# Altium project racer.PrjPcb
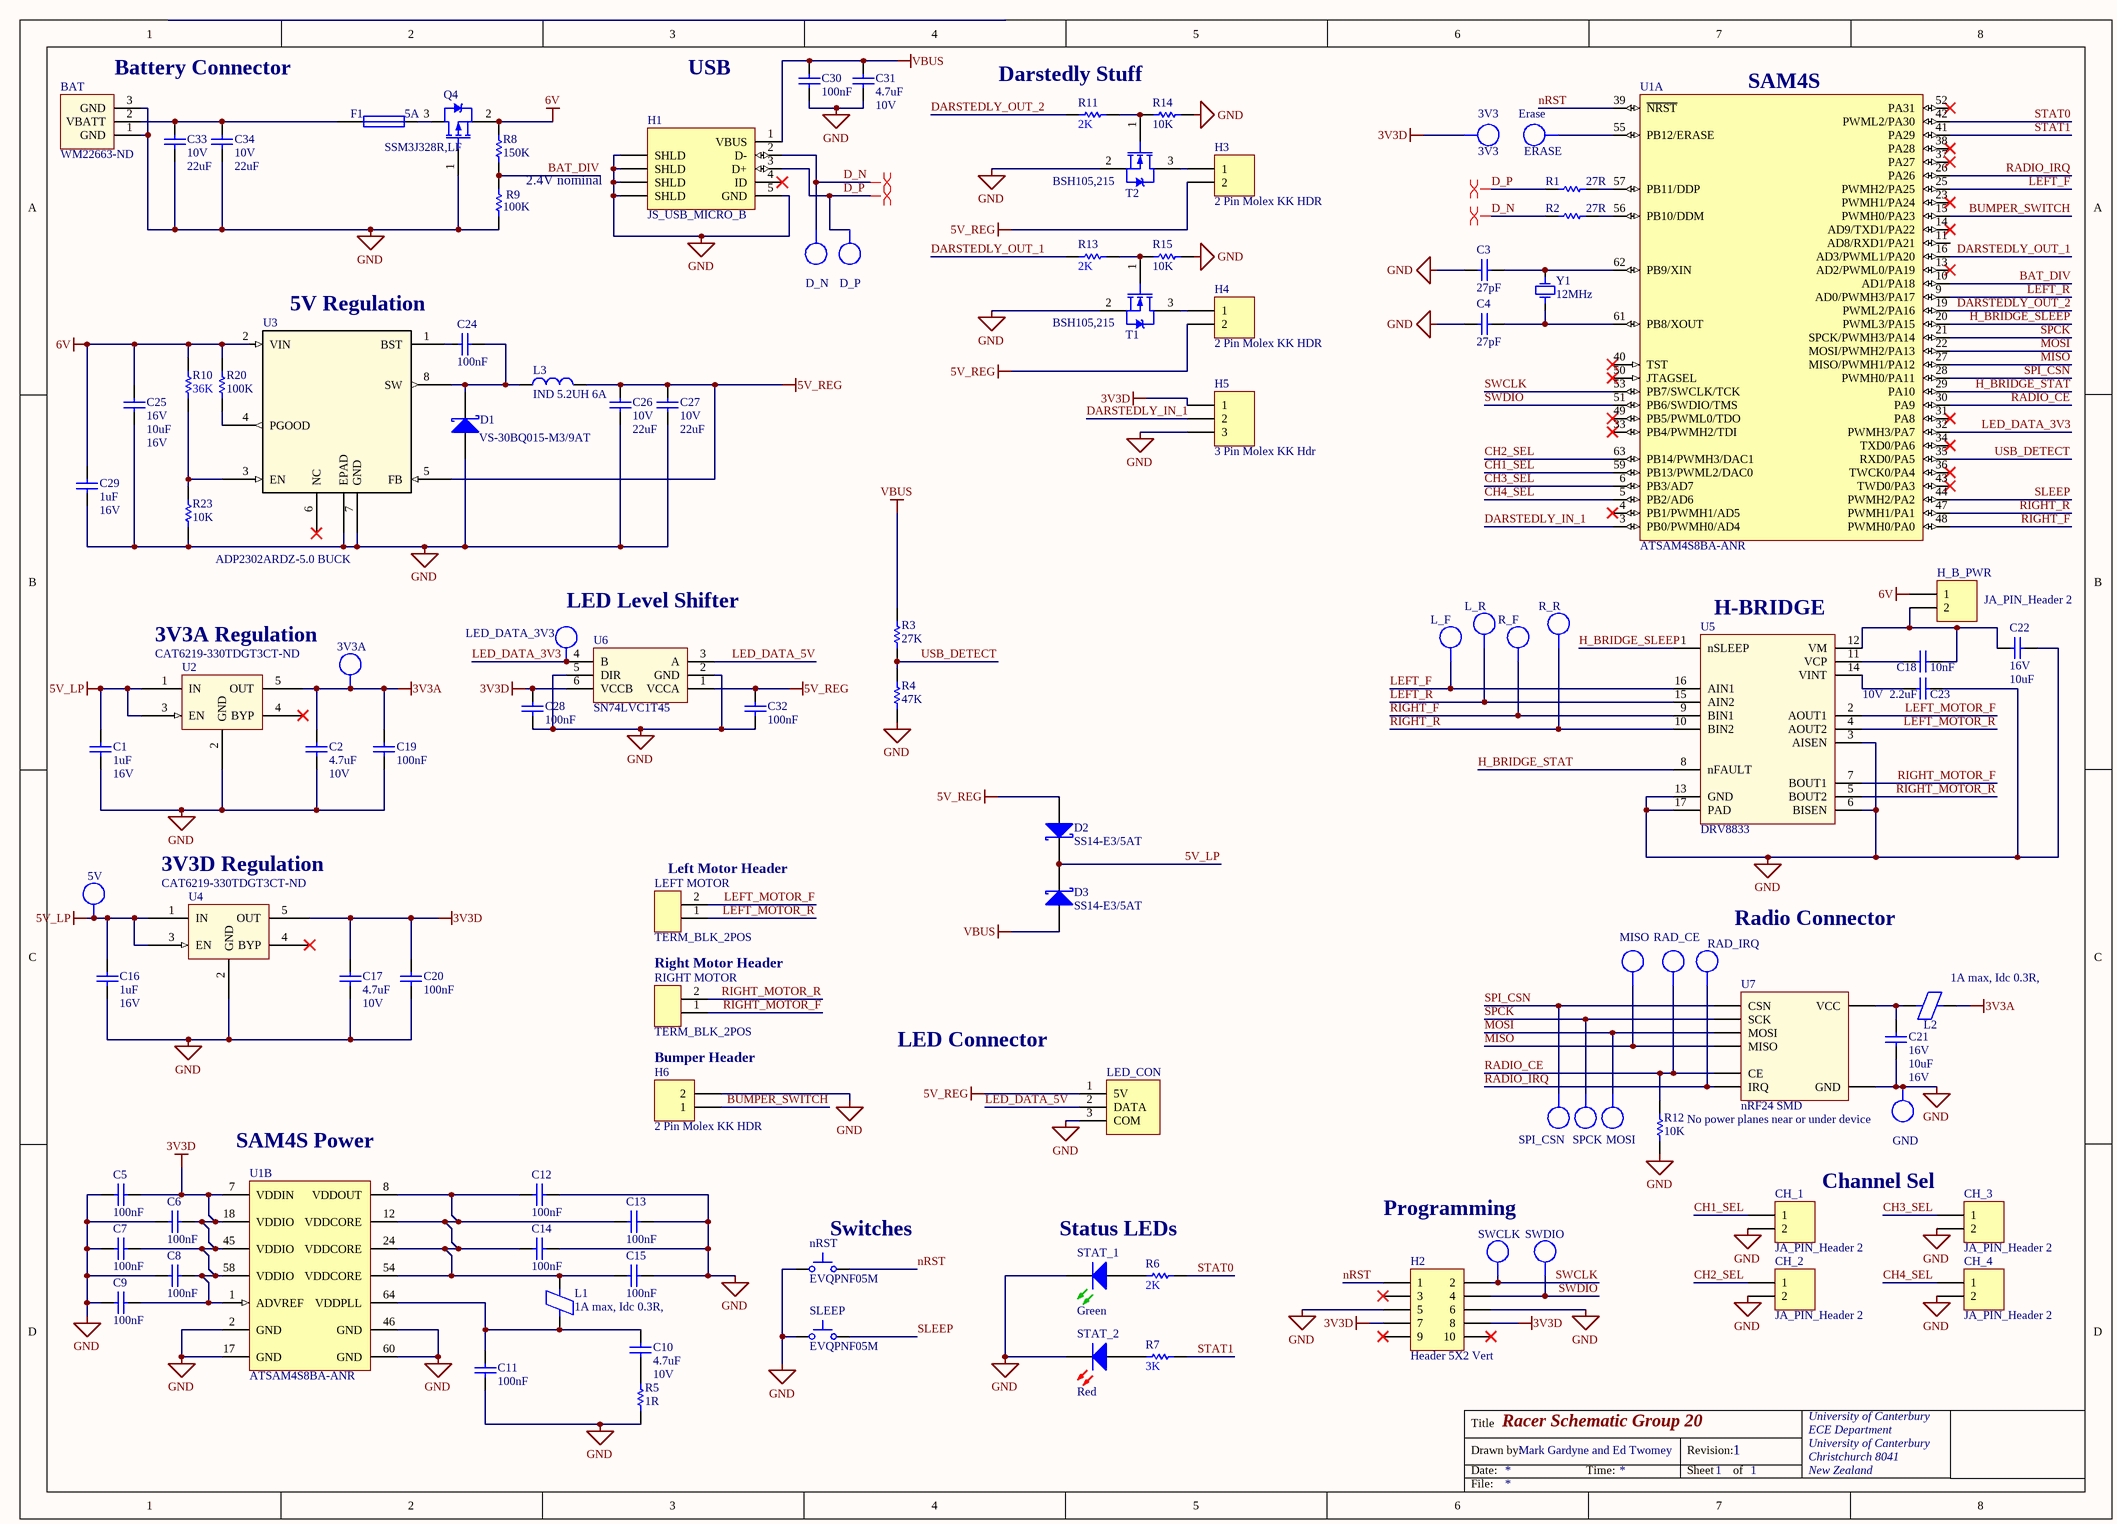
[diagram p0: MCU.SchDoc]
1 sheet, 108 parts. Net scope: global (net labels, ports and power ports of the same name join across sheets).
Board file: racer_pcb.PcbDoc

## Sheet MCU.SchDoc: Racer Schematic Group 20
size A3; Author: Group 20; DrawnBy: Mark Gardyne and Ed Twomey; Organization: University of Canterbury; Address1: ECE Department; Address2: University of Canterbury; Address3: Christchurch 8041; Address4: New Zealand; Revision: 1; SheetNumber: 1; SheetTotal: 1; ImagePath: \\maxwell\elecapp\AltiumDesigner\Templates\uc-logo.png

### Parts
3V3  3V3  [TP_1206]  (no BOM)
3V3A  TP  [TP_1206]  (value not drawn)  (no BOM)
5V  TP  [TP_1206]  (value not drawn)  (no BOM)
BAT  Supplier Part Number 1: WM22663-ND  [BATT_HEADER_3POS]  (hidden comment: Battery_HEADER_3pin)
C1  Max Voltage: 16V  [CAPC1608L]  (hidden comment: 1uF)
C2  Max Voltage: 10V  [CAPC1608N]  (hidden comment: 4.7uF)
C3  27pF  [CAPC1608L]
C4  27pF  [CAPC1608L]
C5  100nF  [CAPC1608L]
C6  100nF  [CAPC1608L]
C7  100nF  [CAPC1608L]
C8  100nF  [CAPC1608L]
C9  100nF  [CAPC1608L]
C10  Max Voltage: 10V  [CAPC1608N]  (hidden comment: 4.7uF)
C11  100nF  [CAPC1608L]
C12  100nF  [CAPC1608L]
C13  100nF  [CAPC1608L]
C14  100nF  [CAPC1608L]
C15  100nF  [CAPC1608L]
C16  Max Voltage: 16V  [CAPC1608L]  (hidden comment: 1uF)
C17  Max Voltage: 10V  [CAPC1608N]  (hidden comment: 4.7uF)
C18  10nF  [CAPC1608L]
C19  100nF  [CAPC1608L]
C20  100nF  [CAPC1608L]
C21  Voltage - Rated: 16V  [CAPC2012L]  (hidden comment: 10uF)
C22  Voltage - Rated: 16V  [CAPC2012L]  (hidden comment: 10uF)
C23  Max Voltage: 10V  [CAPC1608L]  (hidden comment: 2.2uF)
C24  100nF  [CAPC1608L]
C25  Voltage - Rated: 16V  [CAPC2012L]  (hidden comment: 10uF)
C26  Max Voltage: 10V  [CAPC3216L]  (hidden comment: 22uF)
C27  Max Voltage: 10V  [CAPC3216L]  (hidden comment: 22uF)
C28  100nF  [CAPC1608L]
C29  Max Voltage: 16V  [CAPC1608L]  (hidden comment: 1uF)
C30  100nF  [CAPC1608L]
C31  Max Voltage: 10V  [CAPC1608N]  (hidden comment: 4.7uF)
C32  100nF  [CAPC1608L]
C33  Max Voltage: 10V  [CAPC3216L]  (hidden comment: 22uF)
C34  Max Voltage: 10V  [CAPC3216L]  (hidden comment: 22uF)
CH_1  JA_PIN_Header 2  [HDR1X2]
CH_2  JA_PIN_Header 2  [HDR1X2]
CH_3  JA_PIN_Header 2  [HDR1X2]
CH_4  JA_PIN_Header 2  [HDR1X2]
D1  VS-30BQ015-M3/9AT  [SMC]
D2  SS14-E3/5AT  [DIOM4227X23N]
D3  SS14-E3/5AT  [DIOM4227X23N]
D_N  TP  [TP_1206]  (value not drawn)  (no BOM)
D_P  TP  [TP_1206]  (value not drawn)  (no BOM)
ERASE  Erase  [TP_1206]  (no BOM)
F1  5A  [RESC3216N]
GND  TP  [TP_1206]  (value not drawn)  (no BOM)
H1  JS_USB_MICRO_B  [FCI_USB_10118194-0001LF]
H2  Header 5X2 Vert  [IDC2.54-V10D]
H3  2 Pin Molex KK HDR  [MOLEX_KK_2_HDR]
H4  2 Pin Molex KK HDR  [MOLEX_KK_2_HDR]
H5  3 Pin Molex KK Hdr  [MOLEX_KK_3_HDR]
H6  2 Pin Molex KK HDR  [MOLEX_KK_2_HDR]
H_B_PWR  JA_PIN_Header 2  [HDR1X2]
L1  1A max, Idc 0.3R,  [INDC3216L]
L2  1A max, Idc 0.3R,  [INDC3216L]
L3  IND 5.2UH 6A  [INDUCTOR5u2]
L_F  TP  [TP_1206]  (value not drawn)  (no BOM)
L_R  TP  [TP_1206]  (value not drawn)  (no BOM)
LED_CON  3 Pin Molex KK Hdr  [MOLEX_KK_3_HDR]  (value not drawn)
LED_DATA_3V3  TP  [TP_1206]  (value not drawn)  (no BOM)
LEFT_MOTOR  TERM_BLK_2POS  [TERM_BLK_2POS]
MISO  TP  [TP_1206]  (value not drawn)  (no BOM)
MOSI  TP  [TP_1206]  (value not drawn)  (no BOM)
nRST  EVQPNF05M  [EVQPNF05M]
Q4  SSM3J328R,LF  [SOT23_L]
R1  27R  [RESC1608L]
R2  27R  [RESC1608L]
R3  27K  [RESC1608L]
R4  47K  [RESC1608N]
R5  1R  [RESC3216L]
R6  2K  [RESC1608L]
R7  3K  [RESC1608L]
R8  150K  [RESC1608L]
R9  100K  [RESC1608L]
R10  36K  [RESC1608L]
R11  2K  [RESC1608L]
R12  10K  [RESC1608L]
R13  2K  [RESC1608L]
R14  10K  [RESC1608L]
R15  10K  [RESC1608L]
R20  100K  [RESC1608L]
R23  10K  [RESC1608L]
R_F  TP  [TP_1206]  (value not drawn)  (no BOM)
R_R  TP  [TP_1206]  (value not drawn)  (no BOM)
RAD_CE  TP  [TP_1206]  (value not drawn)  (no BOM)
RAD_IRQ  TP  [TP_1206]  (value not drawn)  (no BOM)
RIGHT_MOTOR  TERM_BLK_2POS  [TERM_BLK_2POS]
SLEEP  EVQPNF05M  [EVQPNF05M]
SPCK  TP  [TP_1206]  (value not drawn)  (no BOM)
SPI_CSN  TP  [TP_1206]  (value not drawn)  (no BOM)
STAT_1  Green  [WL-SMCW0603]
STAT_2  Red  [WL-SMCW0603]
SWCLK  TP  [TP_1206]  (value not drawn)  (no BOM)
SWDIO  TP  [TP_1206]  (value not drawn)  (no BOM)
T1  BSH105,215  [SOT23_L]
T2  BSH105,215  [SOT23_L]
U1  ATSAM4S8BA-ANR  [LQFP64_L]  (parts A,B of 2)
U2  Supplier Part Number: CAT6219-330TDGT3CT-ND  [SOT95P280X145-5N]  (hidden comment: CAT6219-330TDGT3)
U3  ADP2302ARDZ-5.0 BUCK  [RD_8_1]
U4  Supplier Part Number: CAT6219-330TDGT3CT-ND  [SOT95P280X145-5N]  (hidden comment: CAT6219-330TDGT3)
U5  DRV8833  [HTSOP16 DRV8833]
U6  SN74LVC1T45  [SOT23-6_N]
U7  nRF24 SMD  Warning: No power planes near or under device  [NRF24]
Y1  12MHz  [6.0X3.5-4]

### Nets
3V3A: 3V3A.1 C2.2 C19.2 L2.1 U2.5(OUT)
3V3D: 3V3.1 C5.2 C6.2 C7.2 C8.2 C9.2 C17.2 C20.2 C28.2 H2.7 H2.8 H5.1 U1.1(ADVREF) U1.7(VDDIN) U1.18(VDDIO) U1.45(VDDIO) U1.58(VDDIO) U4.5(OUT) U6.6(VCCB)
5V_LP: 5V.1 C1.2 C16.2 D2.1(K) D3.1(K) U2.1(IN) U2.3(EN) U4.1(IN) U4.3(EN)
5V_REG: C26.2 C27.2 C32.2 D2.2(A) H3.2 H4.2 L3.2 LED_CON.1(5V) U3.5(FB) U6.1(VCCA)
6V: C25.2 C29.2 H_B_PWR.1 Q4.2 R8.2 R10.2 R20.2 U3.2(VIN)
GND: BAT.1(GND) BAT.3(GND) C1.1 C2.1 C3.1 C4.1 C5.1 C6.1 C7.1 C8.1 C9.1 C11.1 C12.2 C13.2 C14.2 C15.2 C16.1 C17.1 C19.1 C20.1 C21.1 C22.2 C23.2 C25.1 C26.1 C27.1 C28.1 C29.1 C30.1 C31.1 C32.1 C33.1 C34.1 CH_1.2 CH_2.2 CH_3.2 CH_4.2 D1.1(A) GND.1 H1.5(GND) H1.6(SHLD) H2.5 H2.6 H5.3 H6.2 LED_CON.3(COM) nRST.1 Q4.1 R4.2 R5.1 R9.1 R12.1 R14.2 R15.2 R23.1 SLEEP.1 STAT_1.1(K) STAT_2.1(K) T1.2 T2.2 U1.2(GND) U1.17(GND) U1.46(GND) U1.60(GND) U2.2(GND) U3.7(GND) U3.EPAD U4.2(GND) U5.3(AISEN) U5.6(BISEN) U5.13(GND) U5.17(PAD) U6.2(GND) U6.5(DIR) U7.2(GND)
VBUS: C30.2 C31.2 D3.2(A) H1.1(VBUS) R3.2
BAT_DIV: R8.1 R9.2 U1.10(AD1/PA18)
BUMPER_SWITCH: H6.1 U1.15(PWMH0/PA23)
CH1_SEL: CH_1.1 U1.59(PB13/PWML2/DAC0)
CH2_SEL: CH_2.1 U1.63(PB14/PWMH3/DAC1)
CH3_SEL: CH_3.1 U1.6(PB3/AD7)
CH4_SEL: CH_4.1 U1.5(PB2/AD6)
D_N: D_N.1 H1.2(D-) R2.1
D_P: D_P.1 H1.3(D+) R1.1
DARSTEDLY_IN_1: H5.2 U1.3(PB0/PWMH0/AD4)
DARSTEDLY_OUT_1: R13.1 U1.16(AD3/PWML1/PA20)
DARSTEDLY_OUT_2: R11.1 U1.19(PWML2/PA16)
H_BRIDGE_SLEEP: U1.20(PWML3/PA15) U5.1(nSLEEP)
H_BRIDGE_STAT: U1.29(PA10) U5.8(nFAULT)
LED_DATA_3V3: LED_DATA_3V3.1 U1.32(PWMH3/PA7) U6.4(B)
LED_DATA_5V: LED_CON.2(DATA) U6.3(A)
LEFT_F: L_F.1 U1.25(PWMH2/PA25) U5.16(AIN1)
LEFT_MOTOR_F: LEFT_MOTOR.2 U5.2(AOUT1)
LEFT_MOTOR_R: LEFT_MOTOR.1 U5.4(AOUT2)
LEFT_R: L_R.1 U1.9(AD0/PWMH3/PA17) U5.15(AIN2)
MISO: MISO.1 U1.27(MISO/PWMH1/PA12) U7.7(MISO)
MOSI: MOSI.1 U1.22(MOSI/PWMH2/PA13) U7.6(MOSI)
nRST: H2.1 nRST.2 U1.39(~{NRST})
RADIO_CE: R12.2 RAD_CE.1 U1.30(PA9) U7.3(CE)
RADIO_IRQ: RAD_IRQ.1 U1.26(PA26) U7.8(IRQ)
RIGHT_F: R_F.1 U1.48(PWMH0/PA0) U5.9(BIN1)
RIGHT_MOTOR_F: RIGHT_MOTOR.1 U5.7(BOUT1)
RIGHT_MOTOR_R: RIGHT_MOTOR.2 U5.5(BOUT2)
RIGHT_R: R_R.1 U1.47(PWMH1/PA1) U5.10(BIN2)
SLEEP: SLEEP.2 U1.44(PWMH2/PA2)
SPCK: SPCK.1 U1.21(SPCK/PWMH3/PA14) U7.5(SCK)
SPI_CSN: SPI_CSN.1 U1.28(PWMH0/PA11) U7.4(CSN)
STAT0: R6.2 U1.42(PWML2/PA30)
STAT1: R7.2 U1.41(PA29)
SWCLK: H2.2 SWCLK.1 U1.53(PB7/SWCLK/TCK)
SWDIO: H2.4 SWDIO.1 U1.51(PB6/SWDIO/TMS)
USB_DETECT: R3.1 R4.1 U1.35(RXD0/PA5)
NetBAT_2: BAT.2(VBATT) C33.2 C34.2 F1.1
NetC3_2: C3.2 U1.62(PB9/XIN) Y1.3(OSC2)
NetC4_2: C4.2 U1.61(PB8/XOUT) Y1.1(OSC1)
NetC10_1: C10.1 R5.2
NetC10_2: C10.2 C11.2 L1.1 U1.64(VDDPLL)
NetC12_1: C12.1 C13.1 C14.1 C15.1 L1.2 U1.8(VDDOUT) U1.12(VDDCORE) U1.24(VDDCORE) U1.54(VDDCORE)
NetC18_1: C18.1 U5.11(VCP)
NetC18_2: C18.2 C22.1 H_B_PWR.2 U5.12(VM)
NetC21_2: C21.2 L2.2 U7.1(VCC)
NetC23_1: C23.1 U5.14(VINT)
NetC24_1: C24.1 D1.2(K) L3.1 U3.8(SW)
NetC24_2: C24.2 U3.1(BST)
NetERASE_1: ERASE.1 U1.55(PB12/ERASE)
NetF1_2: F1.2 Q4.3
NetH3_1: H3.1 T2.3
NetH4_1: H4.1 T1.3
NetR1_2: R1.2 U1.57(PB11/DDP)
NetR2_2: R2.2 U1.56(PB10/DDM)
NetR6_1: R6.1 STAT_1.2(A)
NetR7_1: R7.1 STAT_2.2(A)
NetR10_1: R10.1 R23.2 U3.3(EN)
NetR11_2: R11.2 R14.1 T2.1
NetR13_2: R13.2 R15.1 T1.1
NetR20_1: R20.1 U3.4(PGOOD)

Not connected (* = marked no-connect by the designer): H1 4(ID)*; H2 3* 9* 10*; U1 4(PB1/PWMH1/AD5)* 11(AD8/RXD1/PA21) 13(AD2/PWML0/PA19)* 14(AD9/TXD1/PA22)* 23(PWMH1/PA24)* 31(PA8)* 33(PB4/PWMH2/TDI)* 34(TXD0/PA6)* 36(TWCK0/PA4)* 37(PA27)* 38(PA28)* 40(TST)* 43(TWD0/PA3)* 49(PB5/PWML0/TDO)* 50(JTAGSEL)* 52(PA31)*; U2 4(BYP)*; U3 6(NC)*; U4 4(BYP)*

### Layout directives
differential pair: D_N, D_P

### Notes on the sheet
- (near BAT) Battery Connector
- USB
- Darstedly Stuff
- (near U1) SAM4S
- 2.4V nominal
- 5V Regulation
- 3V3A Regulation
- LED Level Shifter
- (near U5) H-BRIDGE
- (near U4) 3V3D Regulation
- (near LEFT_MOTOR) Left Motor Header
- Radio Connector
- Right Motor Header
- Bumper Header
- LED Connector
- (near U1) SAM4S Power
- (near CH_3) Channel Sel
- (near nRST) Switches
- Status LEDs
- Programming
- Title
- Drawn by:
- Date:
- Time:
- Revision:
- Sheet
- of
- File:

### Library data of the parts
3V3 ERASE = TP_1206: Test-Point 3.3x1.6x2.1mm SMD; Manufacturer: Harwin Inc; Manufacturer Part Number: S1751-46R; Value: TP; Manufacturer PN: *; Storage Location: ProtoPlace; Mounting Type: Surface Mount; Type: PC Test Point; Supplier 1: Digi-Key; Supplier Part Number 1: 952-1478-2-ND; Supplier 2: Farnell; Supplier Part Number 2: 1826282; Supplier: ECE Dept
3V3A 5V D_N D_P GND L_F L_R LED_DATA_3V3 MISO MOSI R_F R_R RAD_CE RAD_IRQ SPCK SPI_CSN SWCLK SWDIO = TP_1206: Test-Point 3.3x1.6x2.1mm SMD; Manufacturer: Harwin Inc; Manufacturer Part Number: S1751-46R; Manufacturer PN: *; Storage Location: ProtoPlace; Mounting Type: Surface Mount; Type: PC Test Point; Supplier 1: Digi-Key; Supplier Part Number 1: 952-1478-2-ND; Supplier 2: Farnell; Supplier Part Number 2: 1826282; Supplier: ECE Dept; Value: TP
BAT = Battery_HEADER_3pin: 3Pin Header 2.54mm spacing / Digikey #WM22663-ND; Supplier 1: Digi-Key
C1 C16 C29 = CC_1uF_0603: CAP CER 1uF Y5V -20% +80% 16V 0603; PackageReference: 0603; Code_IPC: 1608 [0603]; Verify: *; Supplier: ECE Dept; Storage Location: PCB Assembly WS; Value: 1uF
C2 C10 C17 C31 = CC_4.7uF_0603: CAP CER 4.7uF X5R +-20%  10V 0603; Note: Footprint corresponds to dimensions for bulk cassette packaging. This case size has tightened tolerances.; PackageReference: 0805; Code_IPC: 2012[0805]; Verify: *; Supplier: ECE Dept; Storage Location: PCB Assembly WS; Value: 4.7uF
C3 C4 = CC_27pF_0603: CAP CER 27pF NPO/COG +-5% 50V 0603; PackageReference: 0603; Code_IPC: 1608 [0603]; Verify: *; Supplier: ECE Dept; Storage Location: PCB Assembly WS; Value: 27pF
C5-C9 C11-C15 C19 C20 C24 C28 C30 C32 = CC_100nF_0603: CAP CER 100nF X7R +-10% 50V 0603; PackageReference: 0603; Code_IPC: 1608 [0603]; Verify: *; Supplier: ECE Dept; Storage Location: PCB Assembly WS; Value: 100nF
C18 = CC_10nF_0603: CAP CER 10nF X7R +-10% 50V 0603; PackageReference: 0603; Code_IPC: 1608 [0603]; Verify: *; Supplier: ECE Dept; Storage Location: PCB Assembly WS; Value: 10nF
C21 C22 C25 = CC_10uF_0805_16V: CAP CER 10uF X5R 16V 0805; Manufacturer: Samsung Electro-Mechanics; Manufacturer Part Number: CL21A106KOQNNWE; Note: Footprint corresponds to dimensions for bulk cassette packaging. This case size has tightened tolerances.; Tolerance: ±10%; Notification: Current market demand for these product types have resulted in fluctuating and extending lead times. Lead times may differ.; PackageReference: 0805; Code_IPC: 2012[0805]; Supplier 1: Digi-Key; RoHS: RoHS Compliant; Category: Capacitors; Stock 1: 20000; Pricing 1: 1=0.35, 10=0.25, 100=0.1178, 500=0.08254, 1000=0.06831 (NZD); Packaging: Cut Tape (CT); Part Status: Active; Temperature Coefficient: X5R; Operating Temperature: -55°C ~ 85°C; Features: -; Ratings: -; Applications: General Purpose; Mounting Type: Surface Mount, MLCC; Package / Case: 0805 (2012 Metric); Size / Dimension: 0.079" L x 0.049" W (2.00mm x 1.25mm); Height - Seated (Max): -; Thickness (Max): 0.055" (1.40mm); Lead Spacing: -; Lead Style: -; ComponentLink1URL: http://www.samsungsem.com/kr/support/product-search/mlcc/CL21A106KOQNNWE.jsp; ComponentLink1Description: http://www.samsungsem.com/kr/support/product-search/mlcc/CL21A106KOQNNWE.jsp; Supplier Part Number 1: 1276-2894-1-ND; Value: 10uF
  C21 C25: Max Voltage: 16V
C23 = CC_2.2uF_0603: CAP CER 2.2uF X5R +-20% 10V 0603; PackageReference: 0603; Code_IPC: 1608 [0603]; Verify: *; Supplier: ECE Dept; Storage Location: PCB Assembly WS; Value: 2.2uF
C26 C27 C33 C34 = CC_22uF_1206: CAP CER 22uF Y5V -20% +80% 10V 1206; Verify: *; Supplier: ECE Dept; Storage Location: PCB Assembly WS; Dielectric: Y5V; Footprint: 1206 (3216 metric); Value: 22uF
CH_1-CH_4 H_B_PWR = JA_PIN_Header 2: Header, 2-Pin; LatestRevisionDate: 17-Jul-2002; LatestRevisionNote: Re-released for DXP Platform.; Publisher: Altium Limited
D1 = DS_VS-30BQ015-M3: DIODE, SCHOTTKY, 3A, 15V, DO-214AB / SMC; Manufacturer: Vishay Semiconductors; Forward Voltage: 350mV; Max Forward Surge Current (Ifsm): 650A; Peak Reverse Current: 4mA; Average Rectified Current: 3A; Max Reverse Voltage (DC): 15V; Supplier: Digi-Key; ComponentLink1URL: https://datasheet.ciiva.com/36181/vs-30bq015-m3-9at-36181258.pdf; ComponentLink1Description: https://datasheet.ciiva.com/36181/vs-30bq015-m3-9at-36181258.pdf; Supplier 1: Digi-Key; Supplier 2: Element14; Supplier Part Number 1: VS-30BQ015-M3/9ATGIDKR-ND; Supplier Part Number 2: 2628288; Supplier Part Number: VS-30BQ015-M3/9AT-ND; Manufacturer Part Number: VS-30BQ015-M3/9AT
D2 D3 = DS_SS14E3: DIODE, SCHOTTKY, 1A, 40V, DO-214AC; Manufacturer: VISHAY GENERAL SEMICONDUCTOR; Diode Case Style: DO-214; Forward Current If(AV): 1; Diode Type: Schottky; Package / Case: SMA; Supplier 1: Digi-Key; Supplier Part Number 1: SS14-E3/5ATGICT-ND; Supplier 2: Farnell; Supplier Part Number 2: 9551280; Supplier 3: Mouser; Supplier Part Number 3: 625-SS14-E3/11T; Storage Location: PCB Assembly WS; Supplier: ECE Dept; Manufacturer Part Number: SS14-E3/5AT
F1 = FS_Fuse_5.0A: Fuse 5.0A Fast Acting 1206 SMD; Manufacturer Part Number: C1F5; Manufacturer: Bel TRP; Voltage Rating (AC): 125V; Voltage Rating (DC): 63V; DC Cold Resistance: 19mR; Fuse Type: Board Mount (Cartridge Style Excluded); Approvals: CE,cURus; Mount: Surface Mount; Case/Package: 1206; Number of Pins: 2; Case Code (Metric): 3216; Case Code (Imperial): 1206; Contact Plating: Nickel,Tin; Min Operating Temperature: -55°C; Max Operating Temperature: 125°C; Packaging: Tape and Reel; Voltage Rating: 125V; Length: 0.126inch; Width: 0.062inch; Supplier 1: Digi-Key; Stock 1: 725; Pricing 1: 1=0.32, 5=0.312, 10=0.298, 50=0.2662, 100=0.2479, 250=0.22032, 500=0.1836, 1000=0.17442 (USD); ComponentLink1URL: http://www.farnell.com/datasheets/2571625.pdf; ComponentLink1Description: http://www.farnell.com/datasheets/2571625.pdf; ComponentLink2URL: http://belfuse.com/pdfs/C1F.pdf; ComponentLink2Description: http://belfuse.com/pdfs/C1F.pdf; ComponentLink3URL: http://www.mouser.com/ds/2/643/C1F-594910.pdf; ComponentLink3Description: http://www.mouser.com/ds/2/643/C1F-594910.pdf; ComponentLink4URL: https://belfuse.com/resources/StewartConnector/C1F.pdf; ComponentLink4Description: https://belfuse.com/resources/StewartConnector/C1F.pdf; Current Rating: 5A; Supplier Part Number 1: 507-1886-1-ND; Supplier 2: Element14; Supplier Part Number 2: 2848595; Value: 5A
H1 = JS_USB_MICRO_B_SMT: CONN USB MICRO B RECPT SMT R/A; Manufacturer: FCI; Manufacturer Part Number: 10118194-0001LF; Gender: Receptacle; Number of Contacts: 5; Specifications: USB 2.0; Supplier 1: Digi-Key; Supplier Part Number 1: 609-4618-1-ND; Features: Shielded, Solder Retention; Mounting Type: Surface Mount, Right Angle, Horizontal
H2 = JA_HDR_IDC_5X2_VERT: IDC Header, 2,54mm, 10-Pin, Vert; Supplier: ECE Dept; Supplier 1: Farnell; Supplier Part Number 1: 1096985; Storage Location: ECE Dept Store
H3 H4 H6 = JA_MOLEX_KK_2POS: CONN HEADER 2POS 2.54mm VERT_Thru Hole; Supplier 1: Farnell; Supplier Part Number 1: 1462926; Supplier: ECE Dept; Storage Location: ECE Dept Store; Value: 2 Pin Molex KK HDR
H5 = JA_MOLEX_KK_3POS: CONN HEADER 3POS 2.54mm VERT_Thru Hole; Manufacturer: Molex; Manufacturer PN: 22-23-2031; Supplier Part Number 1: 9731156; Supplier: ECE Dept; Supplier 1: Farnell; Storage Location: ECE Dept Store; Value: 3 Pin Molex KK Hdr
L1 L2 = IN_Ferrite-Bead: Ferrite Bead, Rdc 0.3R, Z100MHZ 600R, Imax 1A, SMD 1206; Manufacturer: FAIR-RITE; Manufacturer PN: 2512066017Y1; DC Current Rating: 1; DC Resistance Max: 0.08; Ferrite Case Style: 1206 ^3216 Metric]; Frequency Range: 50MHz to 1; Impedance: 600; Impedance Tolerance: ± 25%; Supplier: ECE Dept; Storage Location: PCB Assembly WS; Ferrite Mounting: SMD; Supplier 1: Farnell; Supplier Part Number 1: 1612060; Manufacturer Part Number: 2512066017Y1; Value: 1A max, Idc 0.3R,
L3 = CDRH104RNP-5R2NC: FIXED IND 5.2UH 6A 22 MOHM SMD; Manufacturer: Sumida America Components Inc.; Material - Core: Ferrite; Tolerance: ±30%; Current - Saturation: 5.6A; Shielding: Shielded; DC Resistance (DCR): 22 mOhm Max; Supplier 1: Digi-Key; Manufacturer Part Number: CDRH104RNP-5R2NC; RoHS: RoHS Compliant; Category: Inductors, Coils, Chokes; Stock 1: 3849; Pricing 1: 1=2.9, 10=2.678, 100=1.8743, 500=1.5173 (NZD); Packaging: Cut Tape (CT); Part Status: Active; Type: -; Q @ Freq: -; Frequency - Self Resonant: -; Ratings: -; Operating Temperature: -40°C ~ 100°C; Mounting Type: Surface Mount; Package / Case: Nonstandard; Supplier Device Package: -; Size / Dimension: 0.402" L x 0.394" W (10.20mm x 10.00mm); Height - Seated (Max): 0.157" (4.00mm); ComponentLink1URL: http://products.sumida.com/products/pdf/CDRH104R.pdf; ComponentLink1Description: http://products.sumida.com/products/pdf/CDRH104R.pdf; Supplier Part Number 1: 308-2280-1-ND
LED_CON = LED_Strip_Header: CONN HEADER 3POS 2.54mm VERT_Thru Hole; Manufacturer: Molex; Manufacturer PN: 22-23-2031; Supplier Part Number 1: 9731156; Supplier: ECE Dept; Supplier 1: Farnell; Storage Location: ECE Dept Store; Value: 3 Pin Molex KK Hdr
LEFT_MOTOR RIGHT_MOTOR = TERM_BLK_2POS: 2 Position Terminal Block 7.62mm spacing
nRST SLEEP = WS_EVQPNF05M: Panasonic 6 x 3.5mm SMD Light Touch Switch Type SMD; PackageDescription: 6.0 x 3.5 mm; Supplier 1: Farnell; Supplier Part Number 1: 2079481; Manufacturer: Panasonic; Manufacturer PN: EVQPNF05M; Supplier 2: Digi-Key; Supplier Part Number 2: P13598SCT-ND; Storage Location: PCB Assembly WS; Supplier: ECE Dept
Q4 = TM_SSM3J328R: MOSFET P-CH 20V 6A SOT23-3; Manufacturer: Toshiba; FET Feature: Logic Level Gate, 1.5V Drive; FET Type: MOSFET P-Channel, Metal Oxide; Gate Charge (Qg) @ Vgs: 12.8nC @ 4.5V; Input Capacitance (Ciss) @ Vds: 840pF @ 10V; Power - Max: 1W; Rds On Max: 29.8mR; Drain to Source Resistance: 47.4mR; Turn-On Delay Time: 32ns; Power Dissipation: 2W; Number of Channels: 1; Turn-Off Delay Time: 107ns; Gate to Source Voltage (Vgs): 8V; Input Capacitance: 840pF; Element Configuration: Single; Drain to Source Breakdown Voltage: -20V; Vgs(th) (Max) @ Id: 1V @ 1mA; Current - Continuous Drain (Id) @ 25° C: 6A; Drain to Source Voltage (Vdss): 20V; Package / Case: SOT-23-3 Flat Leads; Supplier Device Package: SOT-23F; Pricing: 1=0.79, 10=0.658, 25=0.5772, 100=0.4939, 250=0.42836, 500=0.36284, 1000=0.27972 (NZD); Storage Location: PCB Assembly WS; Supplier: Digi-Key; ComponentLink1URL: https://datasheet.ciiva.com/11158/ssm3j328r-datasheet-en-20140301-11158652.pdf; ComponentLink1Description: https://datasheet.ciiva.com/11158/ssm3j328r-datasheet-en-20140301-11158652.pdf; Supplier Part Number: SSM3J328RLFDKR-ND; Max Operating Temperature: 150°C; Mount: Surface Mount; Packaging: Tape and Reel; Min Operating Temperature: -55°C; Continuous Drain Current (ID): 6A; Radiation Hardening: No; Max Power Dissipation: 1W; Package Quantity: 3000; Case/Package: SOT-23-3; Number of Pins: 3; Number of Elements: 1; Supplier 1: Digi-Key; Supplier Part Number 1: SSM3J328RLFDKR-ND; Manufacturer Part Number: SSM3J328R,LF
R1 R2 = RS_27R: RES 27 OHM 1/10W 5% 0603 SMD; Storage Location: PCB Assembly WS; Supplier: ECE Dept; Value: 27R
R3 = RS_27K: RES 27K OHM 1/10W 5% 0603 SMD; Storage Location: PCB Assembly WS; Supplier: ECE Dept; Value: 27K
R4 = RS_47K: RES 47.0K OHM 1/10W 5% 0603 SMD; Storage Location: PCB Assembly WS; Supplier: ECE Dept; Value: 47K
R5 = RT_1R: RES 1R OHM 1/4W 5% 1206 SMD; Storage Location: PCB Assembly WS; Supplier: ECE Dept; Value: 1R
R6 R11 R13 = RS_2K: RES 2K OHM 1/10W 5% 0603 SMD; Storage Location: PCB Assembly WS; Supplier: ECE Dept; Value: 2K
R7 = RS_3K: RES 3K OHM 1/10W 5% 0603 SMD; Storage Location: PCB Assembly WS; Supplier: ECE Dept; Value: 3K
R8 = RS_150K: RES 150K OHM 1/10W 5% 0603 SMD; Storage Location: PCB Assembly WS; Supplier: ECE Dept; Value: 150K
R9 R20 = RS_100K: RES 100K OHM 1/10W 5% 0603 SMD; Storage Location: PCB Assembly WS; Supplier: ECE Dept; Value: 100K
R10 = RS_36K: RES 36K OHM 1/10W 5% 0603 SMD; Storage Location: PCB Assembly WS; Supplier: ECE Dept; Value: 36K
R12 R14 R15 R23 = RS_10K: RES 10.0K OHM 1/10W 5% 0603 SMD; Storage Location: PCB Assembly WS; Supplier: ECE Dept; Value: 10K
STAT_1 = DL_150060GS75000: LED Green 430mcd 0603 SMD; Manufacturer: WURTH ELEKTRONIK; Forward Current If: 30; Wavelength Typ: 520; Forward Voltage: 3.2; Lens Shape: Rectangular; Luminous Intensity: 430; Viewing Angle: 140°; LED Mounting: SMD; Supplier 1: Farnell; Supplier Part Number 1: 2322070; Manufacturer Part Number: 150060GS75000; Storage Location: PCB Assembly WS; Supplier: ECE Dept; LED Colour: Green
STAT_2 = DL_150060RS75000: LED Red 250mcd 0603 SMD; Manufacturer: WURTH ELEKTRONIK; Forward Current If: 30; Forward Voltage: 2; Lens Shape: Rectangular; Luminous Intensity: 250; Wavelength Typ: 625; Viewing Angle: 140°; LED Mounting: SMD; Supplier 1: Farnell; Supplier Part Number 1: 2322071; Manufacturer Part Number: 150060RS75000; Storage Location: PCB Assembly WS; Supplier: ECE Dept; LED Colour: Red
T1 T2 = TM_BSH105: MOSFET N-CH 20V 1.05A SOT-23; Manufacturer: NXP Semiconductors; FET Type: MOSFET N-Channel, Metal Oxide; Gate Charge (Qg) @ Vgs: 3.9nC @ 4.5V; Input Capacitance (Ciss) @ Vds: 152pF @ 16V; Power - Max: 417mW; Rds On (Max) @ Id, Vgs: 200 mOhm @ 600mA, 4.5V; Supplier 1: Farnell; Supplier 2: Digi-Key; Current - Continuous Drain (Id) @ 25° C: 1.05A; Drain to Source Voltage (Vdss): 20V; Package / Case: TO-236-3, SC-59, SOT-23-3; Pricing: 1=0.53, 10=0.42, 25=0.3544, 100=0.2885, 250=0.23896, 500=0.1974, 1000=0.14785 (NZD); Supplier Part Number 1: 1758066; Supplier Part Number 2: 568-6215-1-ND; Storage Location: PCB Assembly WS; Supplier: ECE Dept; Manufacturer Part Number: BSH105,215
U1 = SE_ATSAM4S16BA-MU: IC MCU 32BIT 512KB FLASH 64LQFP; Manufacturer: Atmel; Connectivity: I²C, IrDA, Memory Card, SPI, SSC, UART/USART, USB; Core Processor: ARM® Cortex®-M4; Core Size: 32-Bit; Data Converters: A/D 11x12b, D/A 2x12b; Number of I/O: 47; Peripherals: Brown-out Detect/Reset, DMA, POR, PWM, WDT; Program Memory Size: 512KB (512K x 8); RAM Size: 128K x 8; Speed: 120MHz; Voltage - Supply (Vcc/Vdd): 1.62 V ~ 3.6 V; PackageVersion: revJ, Jul-2007; PackageReference: 64PS; PackageDescription: 64-Pin Quad Flat No-Lead (QFN) Sawn, 9 x 9 x 1.0 mm Body, 0.5 mm Pitch, Exposed Pad; Code_JEDEC: MO-220VMMD-3; ComponentLink1Description: Manufacturer URL; ComponentLink1URL: http://www.atmel.com/; ComponentLink2Description: SAM4S Series Datasheet; ComponentLink2URL: http://www.atmel.com/dyn/resources/prod_documents/11100.pdf; ComponentLink3Description: SAM4S Series Summary; ComponentLink3URL: http://www.atmel.com/dyn/resources/prod_documents/11100S.pdf; Supplier 1: Digi-Key; Package / Case: 64-LQFP; Packaging: Cut Tape (CT); Program Memory Type: FLASH; Supplier Part Number 1: ATSAM4S8BA-ANRCT-ND; Manufacturer Part Number: ATSAM4S8BA-ANR
U2 U4 = SV_CAT6219-330TDGT3: IC REG LIN 3.3V 500MA TSOT23-5; Voltage - Input (Max): 5.5V; Voltage Dropout (Max): 0.5V @ 500mA; Manufacturer Part Number: CAT6219-330TDGT3; Base Part Number: CAT6219; Current - Output: 500mA; Package / Case: SOT-23-5 Thin, TSOT-23-5; Supplier: Digi-Key; Supplier Device Package: TSOT-23-5; Voltage - Output (Min/Fixed): 3.3V; ComponentLink1URL: http://www.onsemi.com/pub/Collateral/CAT6219-D.PDF; ComponentLink1Description: http://www.onsemi.com/pub/Collateral/CAT6219-D.PDF; Supplier 1: Digi-Key
U3 = ADP2302ARDZ-5.0-R7: IC REG BUCK 5V 2A 8SOIC; Vendor: Analog Devices Inc; Frequency - Switching: 700kHz; Output Type: Fixed; Voltage - Input (Max): 20V; Manufacturer_Part_Number: ADP2302ARDZ-5.0-R7; Type: DEV; Value: Value; Supplier 1: Digi-Key; Current - Output: 2A; Voltage - Output (Min/Fixed): 5V; Supplier Part Number 1: ADP2302ARDZ-5.0-R7CT-ND
U5 = DRV8833: Dual H-Bridge Motor Driver 1.5A
U6 = SN74LVC1T45: 1.8V - 5V level converter
U7 = NRF24: nRF24 SMD Module
Y1 = XT_CRYSTAL_12MHz_18pF: CRYSTAL 12MHZ 18PF 6X3.5mm SMD; Manufacturer: CTS-Frequency Controls; Manufacturer Part Number: 406C35D12M00000; ESR (Equivalent Series Resistance): 60 Ohm; Frequency Stability: ±50ppm; Frequency Tolerance: ±30ppm; Operating Mode: Fundamental; Supplier 1: Digi-Key; Height: 0.047" (1.20mm); Load Capacitance: 18pF; Mounting Type: Surface Mount; Operating Temperature: -20°C ~ 70°C; Package / Case: 4-SMD, No Lead (DFN, LCC); Size / Dimension: 0.236" L x 0.138" W (6.00mm x 3.50mm); Supplier Part Number 1: CTX855CT-ND; Frequency: 12MHz